# Altium project MFC.PrjPcb
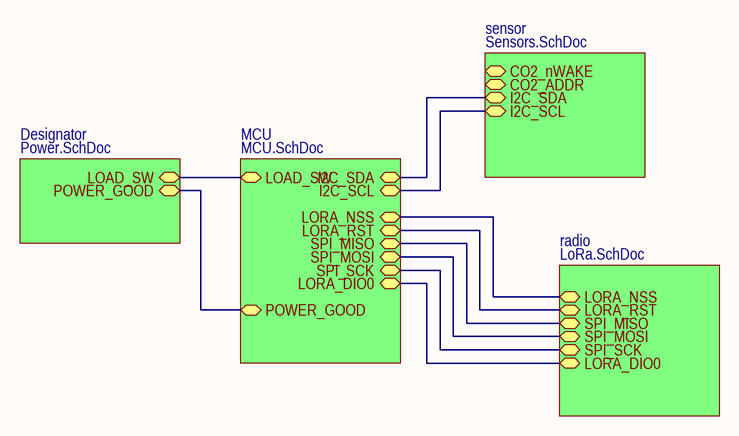
[diagram p0: Main.SchDoc]
5 sheets, 25 parts. Net scope: hierarchical (ports join the sheet entries above them; power ports are global).
Board file: MFC.PcbDoc
Sheets:
  Main.SchDoc
    Designator = Power.SchDoc
    MCU = MCU.SchDoc
    radio = LoRa.SchDoc
    sensor = Sensors.SchDoc

## Sheet Main.SchDoc: Наименование
size 209 x 297 mm; ApprovedBy: Утвердил; CheckedBy: Проверил; Author: Разработал; CompanyName: Организация; DrawnBy: Н.Контр; Engineer: Т.Контр; SheetNumber: 1; SheetTotal: 5; PageSetup: Record=PageOptions|CenterHorizontal=True|CenterVertical=True|PrintScale=0.94|XCorrection=1.00|YCorrection=1.00|PrintKind=1|BorderSize=5000000|LeftOffset=0|BottomOffset=0|Orientation=1|PaperLength=1000|PaperWidth=1000|Scale=100|PaperSource=7|PrintQuality=-4|MediaType=1|DitherType=10|PaperKind=A4|PrintScaleMode=1; DecimalNumber: Децимальный номер; HeadOfSector: Нач. сектора; MainDevice: Перв.примен.; Name: Наименование; DocumentName: Sheet1.SCHDOC

### Sub-sheets
Designator = Power.SchDoc: LOAD_SW (bidir), POWER_GOOD (bidir)
MCU = MCU.SchDoc: I2C_SDA (bidir), I2C_SCL (bidir), SPI_MISO (bidir), SPI_MOSI (bidir), SPI_SCK (bidir), LORA_RST (bidir), LOAD_SW (bidir), LORA_DIO0 (bidir), LORA_NSS (bidir), POWER_GOOD (bidir)
radio = LoRa.SchDoc: LORA_DIO0 (bidir), LORA_NSS (bidir), LORA_RST (bidir), SPI_MISO (bidir), SPI_MOSI (bidir), SPI_SCK (bidir)
sensor = Sensors.SchDoc: CO2_ADDR (bidir), I2C_SDA (bidir), CO2_nWAKE (bidir), I2C_SCL (bidir)

### Nets
I2C_SCL: sheet MCU/I2C_SCL, sheet sensor/I2C_SCL
I2C_SDA: sheet MCU/I2C_SDA, sheet sensor/I2C_SDA
LOAD_SW: sheet Designator/LOAD_SW, sheet MCU/LOAD_SW
LORA_DIO0: sheet MCU/LORA_DIO0, sheet radio/LORA_DIO0
LORA_MISO: sheet MCU/SPI_MISO, sheet radio/SPI_MISO
LORA_MOSI: sheet MCU/SPI_MOSI, sheet radio/SPI_MOSI
LORA_NSS: sheet MCU/LORA_NSS, sheet radio/LORA_NSS
LORA_RST: sheet MCU/LORA_RST, sheet radio/LORA_RST
LORA_SCK: sheet MCU/SPI_SCK, sheet radio/SPI_SCK
NetDA1_6: sheet Designator/POWER_GOOD, sheet MCU/POWER_GOOD

### Notes on the sheet
- Перв.примен.
- Справ.№
- Подп. и дата
- Инв.№ дубл.
- Взам.инв.№
- Подп.и дата
- Разраб.
- Изм.
- Лист
- № докум.
- Подп.
- Дата
- Лит.
- Масштаб
- Масса
- Т.контр.
- Пров.
- ПРИНЦИПИАЛЬНАЯ
- СХЕМА   ЭЛЕКТРИЧЕСКАЯ
- Листов
- Инв.№ подл.
- Утв.
- Н.контр.
- Нач.сект.
- Копировал
- Формат  A3

## Sheet Power.SchDoc: Наименование
size 209 x 297 mm; ApprovedBy: Утвердил; CheckedBy: Проверил; Author: Разработал; CompanyName: Организация; DrawnBy: Н.Контр; Engineer: Т.Контр; SheetNumber: 2; SheetTotal: 5; PageSetup: Record=PageOptions|CenterHorizontal=True|CenterVertical=True|PrintScale=0.94|XCorrection=1.00|YCorrection=1.00|PrintKind=1|BorderSize=5000000|LeftOffset=0|BottomOffset=0|Orientation=1|PaperLength=1000|PaperWidth=1000|Scale=100|PaperSource=7|PrintQuality=-4|MediaType=1|DitherType=10|PaperKind=A4|PrintScaleMode=1; DecimalNumber: Децимальный номер; HeadOfSector: Нач. сектора; MainDevice: Перв.примен.; Name: Наименование; DocumentName: Sheet1.SCHDOC
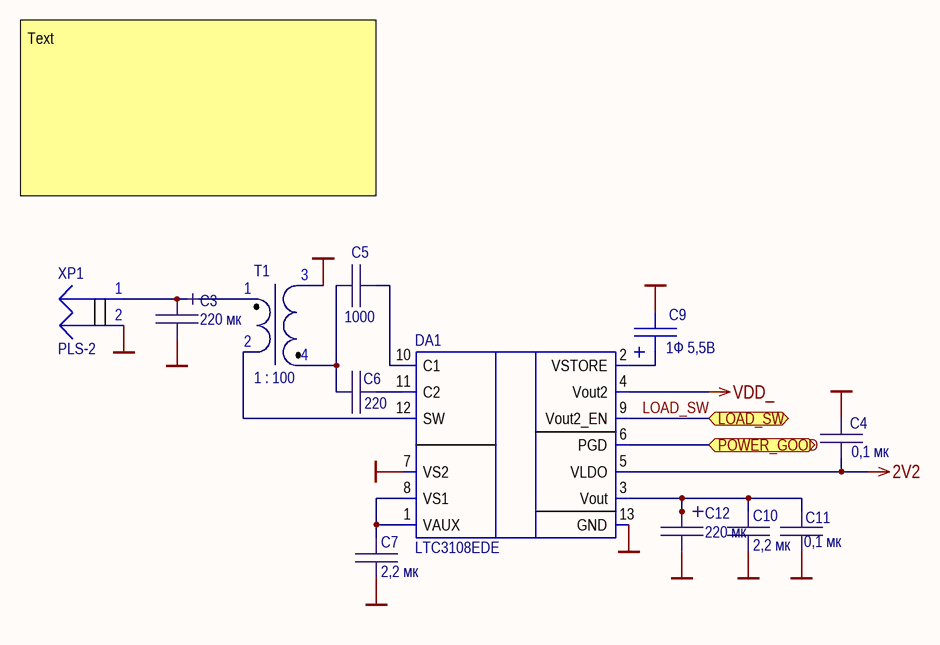
[diagram p1: Power.SchDoc]

### Parts
C3  220 мк  [B_CASE]
C4  0,1 мк  [C_0603]
C5  1000  [C_0603]
C6  220  [C_0603]
C7  2,2 мк  [C_0603]
C9  1Ф 5,5В  [EECF5R5u]
C10  2,2 мк  [C_0603]
C11  0,1 мк  [C_0603]
C12  220 мк  [B_CASE]
DA1  LTC3108EDE  [DFN-12]
T1  1 : 100  [LPR6235]
XP1  PLS-2  [PLS-2]

### Ports
LOAD_SW (bidir), POWER_GOOD (bidir)

### Nets
2V2: C4.2 DA1.5(VLDO)
GND: C3.2 C4.1 C7.1 C9.2 C10.1 C11.1 C12.2 DA1.7(VS2) DA1.13(GND) T1.3 XP1.2
VDD_: DA1.4(Vout2)
LOAD_SW: DA1.9(Vout2_EN) ; port LOAD_SW
NetC3_1: C3.1 T1.1 XP1.1
NetC5_1: C5.1 C6.1 T1.4
NetC5_2: C5.2 DA1.10(C1)
NetC6_2: C6.2 DA1.11(C2)
NetC7_2: C7.2 DA1.1(VAUX) DA1.8(VS1)
NetC9_1: C9.1 DA1.2(VSTORE)
NetC10_2: C10.2 C11.2 C12.1 DA1.3(Vout)
NetDA1_6: DA1.6(PGD) ; port POWER_GOOD
NetDA1_12: DA1.12(SW) T1.2

### Notes on the sheet
- Text
- Подп. и дата
- Инв.№ дубл.
- Взам.инв.№
- Подп.и дата
- Инв.№ подл.
- Изм.
- Лист
- № докум.
- Подп.
- Дата
- Формат  A4

### Library data of the parts
C3 C12 = TAJB227K002RNJ: CAP TANT 220UF 10% 2.5V 1411; Manufacturer: AVX Corporation; Value: 220µF; Part Number: TAJB227K002RNJ; ComponentLink1URL: http://datasheets.avx.com/TAJ.pdf; ComponentLink1Description: Datasheet; Component Type: Tantalum Capacitor
C4 C11 = GRM188R72A104MA35D: CAP CER 0.1UF 100V X7R 0603; Manufacturer: Murata Electronics; Value: 0.1µF; Part Number: GRM188R72A104MA35D; ComponentLink1URL: https://search.murata.co.jp/Ceramy/image/img/A01X/G101/ENG/GRM188R72A104MA35-01.pdf; ComponentLink1Description: Datasheet; Component Type: Capasitor
C5 = GRM1885C1H102FA01J: CAP CER 1000PF 50V C0G/NP0 0603; Manufacturer: Murata Electronics; Part Number: GRM1885C1H102FA01J; Value: 1000pF; ComponentLink1URL: https://www.murata.com/~/media/webrenewal/support/library/catalog/products/capacitor/mlcc/c02e.ashx?la=en-us; ComponentLink1Description: Datasheet; Component Type: Capasitor
C6 = GRM1885C2A221FA01D: CAP CER 220PF 100V C0G/NP0 0603; Manufacturer: Murata Electronics; Part Number: GRM1885C2A221FA01D; Value: 220pF; ComponentLink1URL: https://www.murata.com/~/media/webrenewal/support/library/catalog/products/capacitor/mlcc/c02e.ashx?la=en-us; ComponentLink1Description: Datasheet; Component Type: Capasitor
C7 C10 = GRM188R61E225MA12D: CAP CER 2.2UF 25V X5R 0603; Manufacturer: Murata Electronics; Value: 2.2µF; Part Number: GRM188R61E225MA12D; ComponentLink1URL: https://search.murata.co.jp/Ceramy/image/img/A01X/G101/ENG/GRM188R61E225MA12-01.pdf; ComponentLink1Description: Datasheet; Component Type: Capasitor
C9 = EECF5R5U105: 1 Ф, 5.5 В, 5 мм, 2208H, Ионистор
DA1 = LTC3108EDE: Ultralow Voltage Step-Up Converter and Power Manager
T1 = LPR6235-752SMR: Coupled Inductor

## Sheet MCU.SchDoc: Наименование
size 209 x 297 mm; ApprovedBy: Утвердил; CheckedBy: Проверил; Author: Разработал; CompanyName: Организация; DrawnBy: Н.Контр; Engineer: Т.Контр; SheetNumber: 3; SheetTotal: 5; PageSetup: Record=PageOptions|CenterHorizontal=True|CenterVertical=True|PrintScale=0.94|XCorrection=1.00|YCorrection=1.00|PrintKind=1|BorderSize=5000000|LeftOffset=0|BottomOffset=0|Orientation=1|PaperLength=1000|PaperWidth=1000|Scale=100|PaperSource=7|PrintQuality=-4|MediaType=1|DitherType=10|PaperKind=A4|PrintScaleMode=1; DecimalNumber: Децимальный номер; HeadOfSector: Нач. сектора; MainDevice: Перв.примен.; Name: Наименование; DocumentName: Sheet1.SCHDOC
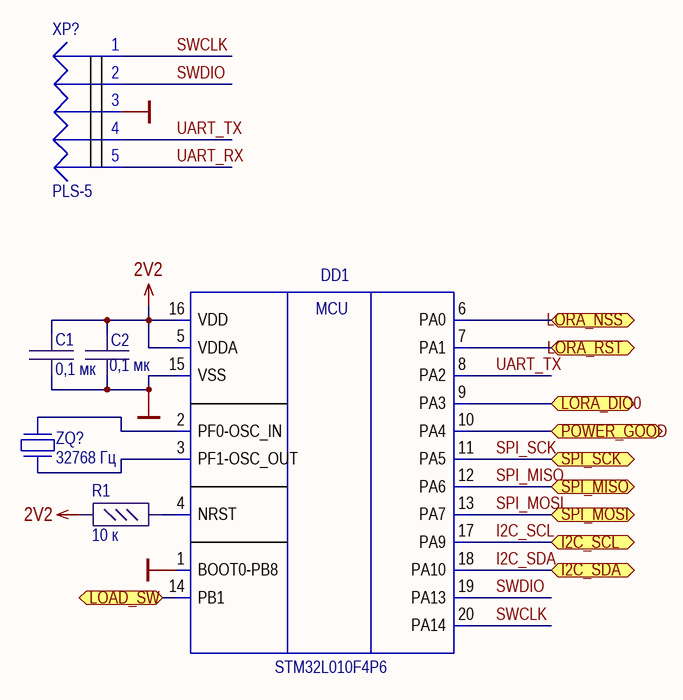
[diagram p2: MCU.SchDoc]

### Parts
C1  0,1 мк  [C_0603]
C2  0,1 мк  [C_0603]
DD1  STM32L010F4P6  [TSSOP-20]
R1  10 к  [R_0603]
XP?  PLS-5  [PLS-5]
ZQ?  32768 Гц  [DT-38T]

### Ports
I2C_SCL (bidir), I2C_SDA (bidir), LOAD_SW (bidir), LORA_DIO0 (bidir), LORA_NSS (bidir), LORA_RST (bidir), POWER_GOOD (bidir), SPI_MISO (bidir), SPI_MOSI (bidir), SPI_SCK (bidir)

### Nets
2V2: C1.2 C2.2 DD1.5(VDDA) DD1.16(VDD) R1.1
GND: C1.1 C2.1 DD1.1(BOOT0-PB8) DD1.15(VSS) XP?.3
I2C_SCL: DD1.17(PA9) ; port I2C_SCL
I2C_SDA: DD1.18(PA10) ; port I2C_SDA
LOAD_SW: DD1.14(PB1) ; port LOAD_SW
LORA_DIO0: DD1.9(PA3) ; port LORA_DIO0
LORA_NSS: DD1.6(PA0) ; port LORA_NSS
LORA_RST: DD1.7(PA1) ; port LORA_RST
SPI_MISO: DD1.12(PA6) ; port SPI_MISO  [project net LORA_MISO]
SPI_MOSI: DD1.13(PA7) ; port SPI_MOSI  [project net LORA_MOSI]
SPI_SCK: DD1.11(PA5) ; port SPI_SCK  [project net LORA_SCK]
SWCLK: DD1.20(PA14) XP?.1
SWDIO: DD1.19(PA13) XP?.2
UART_RX: XP?.5
UART_TX: DD1.8(PA2) XP?.4
NetDA1_6: DD1.10(PA4) ; port POWER_GOOD
NetDD1_2: DD1.2(PF0-OSC_IN) ZQ?.2
NetDD1_3: DD1.3(PF1-OSC_OUT) ZQ?.1
NetDD1_4: DD1.4(NRST) R1.2

### Notes on the sheet
- Подп. и дата
- Инв.№ дубл.
- Взам.инв.№
- Подп.и дата
- Инв.№ подл.
- Изм.
- Лист
- № докум.
- Подп.
- Дата
- Формат  A4
- (in symbol STM32L010F4P6) MCU

### Library data of the parts
C1 C2 = GRM188R72A104MA35D: as C4 on sheet Power; Part Number: GRM188R72A104MA35D; ComponentLink1URL: https://search.murata.co.jp/Ceramy/image/img/A01X/G101/ENG/GRM188R72A104MA35-01.pdf; ComponentLink1Description: Datasheet; Component Type: Capasitor
R1 = CR0603-FX-1002ELF: RES SMD 10K OHM 1% 1/10W 0603; Manufacturer: Bourns Inc.; Part Number: CR0603-FX-1002ELF; Value: 10 к; ComponentLink1URL: https://www.bourns.com/pdfs/chpreztr.pdf; ComponentLink1Description: Datasheet; Component Type: Resistor
ZQ? = FTX32.768K12.5D8-20D

## Sheet LoRa.SchDoc: Наименование
size 209 x 297 mm; ApprovedBy: Утвердил; CheckedBy: Проверил; Author: Разработал; CompanyName: Организация; DrawnBy: Н.Контр; Engineer: Т.Контр; SheetNumber: 4; SheetTotal: 5; PageSetup: Record=PageOptions|CenterHorizontal=True|CenterVertical=True|PrintScale=0.94|XCorrection=1.00|YCorrection=1.00|PrintKind=1|BorderSize=5000000|LeftOffset=0|BottomOffset=0|Orientation=1|PaperLength=1000|PaperWidth=1000|Scale=100|PaperSource=7|PrintQuality=-4|MediaType=1|DitherType=10|PaperKind=A4|PrintScaleMode=1; DecimalNumber: Децимальный номер; HeadOfSector: Нач. сектора; MainDevice: Перв.примен.; Name: Наименование; DocumentName: Sheet1.SCHDOC
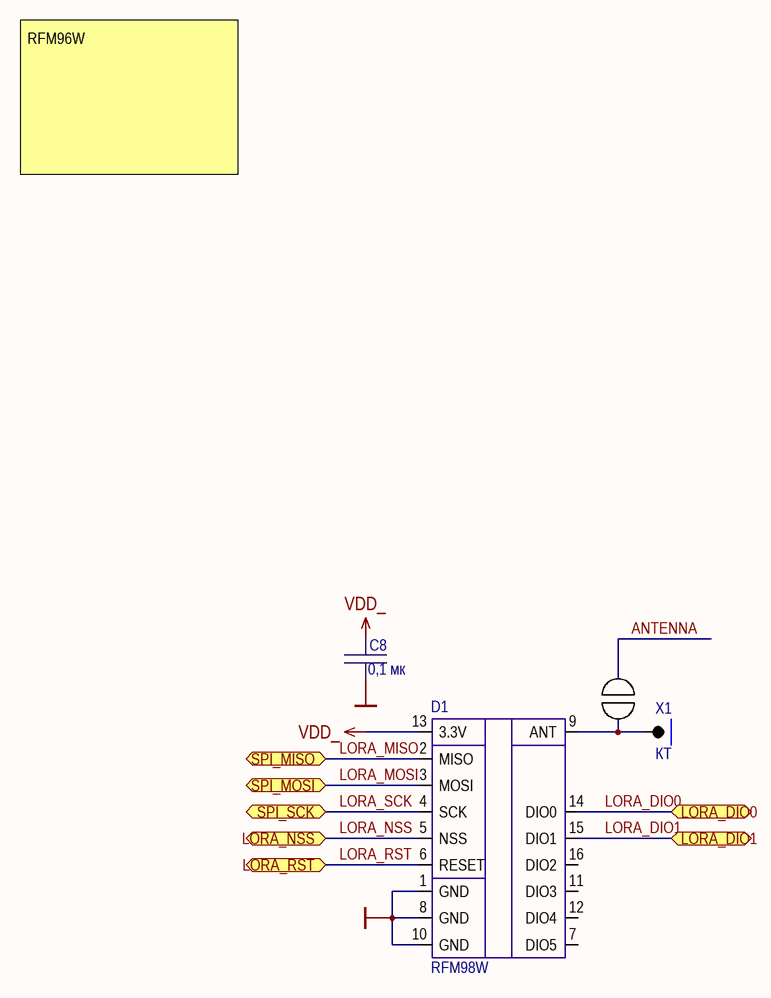
[diagram p3: LoRa.SchDoc]

### Parts
C8  0,1 мк  [C_0603]
D1  RFM98W  [RFM98W]
X1  КТ  [KT]
X?  Solder_jumper  [Solder_jumper]  (value not drawn)

### Ports
LORA_DIO0 (bidir), LORA_DIO1 (bidir), LORA_NSS (bidir), LORA_RST (bidir), SPI_MISO (bidir), SPI_MOSI (bidir), SPI_SCK (bidir)

### Nets
GND: C8.1 D1.1(GND) D1.8(GND) D1.10(GND)
VDD_: C8.2 D1.13(3.3V)
ANTENNA: X?.2
LORA_DIO0: D1.14(DIO0) ; port LORA_DIO0
LORA_DIO1: D1.15(DIO1) ; port LORA_DIO1
LORA_MISO: D1.2(MISO) ; port SPI_MISO
LORA_MOSI: D1.3(MOSI) ; port SPI_MOSI
LORA_NSS: D1.5(NSS) ; port LORA_NSS
LORA_RST: D1.6(RESET) ; port LORA_RST
LORA_SCK: D1.4(SCK) ; port SPI_SCK
NetD1_9: D1.9(ANT) X1.1 X?.1

Not connected (* = marked no-connect by the designer): D1 7(DIO5) 11(DIO3) 12(DIO4) 16(DIO2)

### Notes on the sheet
- RFM96W
- Подп. и дата
- Инв.№ дубл.
- Взам.инв.№
- Подп.и дата
- Инв.№ подл.
- Изм.
- Лист
- № докум.
- Подп.
- Дата
- Формат  A4

### Library data of the parts
C8 = GRM188R72A104MA35D: as C4 on sheet Power; Part Number: GRM188R72A104MA35D; ComponentLink1URL: https://search.murata.co.jp/Ceramy/image/img/A01X/G101/ENG/GRM188R72A104MA35-01.pdf; ComponentLink1Description: Datasheet; Component Type: Capasitor
D1 = RFM98W: LoRa modem

## Sheet Sensors.SchDoc: Наименование
size 209 x 297 mm; ApprovedBy: Утвердил; CheckedBy: Проверил; Author: Разработал; CompanyName: Организация; DrawnBy: Н.Контр; Engineer: Т.Контр; SheetNumber: 5; SheetTotal: 5; PageSetup: Record=PageOptions|CenterHorizontal=True|CenterVertical=True|PrintScale=0.94|XCorrection=1.00|YCorrection=1.00|PrintKind=1|BorderSize=5000000|LeftOffset=0|BottomOffset=0|Orientation=1|PaperLength=1000|PaperWidth=1000|Scale=100|PaperSource=7|PrintQuality=-4|MediaType=1|DitherType=10|PaperKind=A4|PrintScaleMode=1; DecimalNumber: Децимальный номер; HeadOfSector: Нач. сектора; MainDevice: Перв.примен.; Name: Наименование; DocumentName: Sheet1.SCHDOC
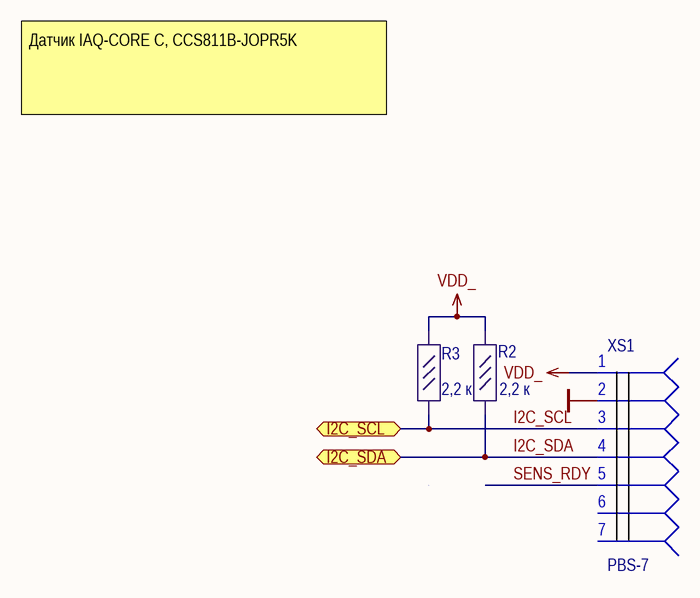
[diagram p4: Sensors.SchDoc]

### Parts
R2  2,2 к  [R_0603]
R3  2,2 к  [R_0603]
XS1  PBS-7  [PBS-7]

### Ports
I2C_SCL (bidir), I2C_SDA (bidir)

### Nets
GND: XS1.2
VDD_: R2.2 R3.2 XS1.1
I2C_SCL: R3.1 XS1.3 ; port I2C_SCL
I2C_SDA: R2.1 XS1.4 ; port I2C_SDA
SENS_RDY: XS1.5

Not connected (* = marked no-connect by the designer): XS1 6 7

### Notes on the sheet
- Датчик IAQ-CORE C, CCS811B-JOPR5K
- Подп. и дата
- Инв.№ дубл.
- Взам.инв.№
- Подп.и дата
- Инв.№ подл.
- Изм.
- Лист
- № докум.
- Подп.
- Дата
- Формат  A4

### Library data of the parts
R2 R3 = CR0603-FX-2201ELF: RES SMD 2.2K OHM 1% 1/10W 0603; Manufacturer: Bourns Inc.; Part Number: CR0603-FX-2201ELF; Value: 2,2 к; ComponentLink1URL: https://www.bourns.com/pdfs/chpreztr.pdf; ComponentLink1Description: Datasheet; Component Type: Resistor

## Nets that join several sheets
2V2: Power (C4.2 DA1.5), MCU (5 pins)
GND: Power (11 pins), MCU (5 pins), LoRa (C8.1 D1.1 D1.8 D1.10), Sensors (XS1.2)
VDD_: Power (DA1.4), LoRa (C8.2 D1.13), Sensors (R2.2 R3.2 XS1.1)
I2C_SCL: MCU (DD1.17), Sensors (R3.1 XS1.3)
I2C_SDA: MCU (DD1.18), Sensors (R2.1 XS1.4)
LOAD_SW: Power (DA1.9), MCU (DD1.14)
LORA_DIO0: MCU (DD1.9), LoRa (D1.14)
LORA_MISO: MCU (DD1.12), LoRa (D1.2)
LORA_MOSI: MCU (DD1.13), LoRa (D1.3)
LORA_NSS: MCU (DD1.6), LoRa (D1.5)
LORA_RST: MCU (DD1.7), LoRa (D1.6)
LORA_SCK: MCU (DD1.11), LoRa (D1.4)
NetDA1_6: Power (DA1.6), MCU (DD1.10)